# Altium schematic sheet 801_USBHub-Framework.SchDoc: USB Hub Framework Modules
size A2; Organization: Greenfield Tech Solutions; Address1: Molendreef 33; Address2: Ossendrecht; Address3: 4641CS; Address4: The Netherlands; SheetNumber: 9; SheetTotal: 9
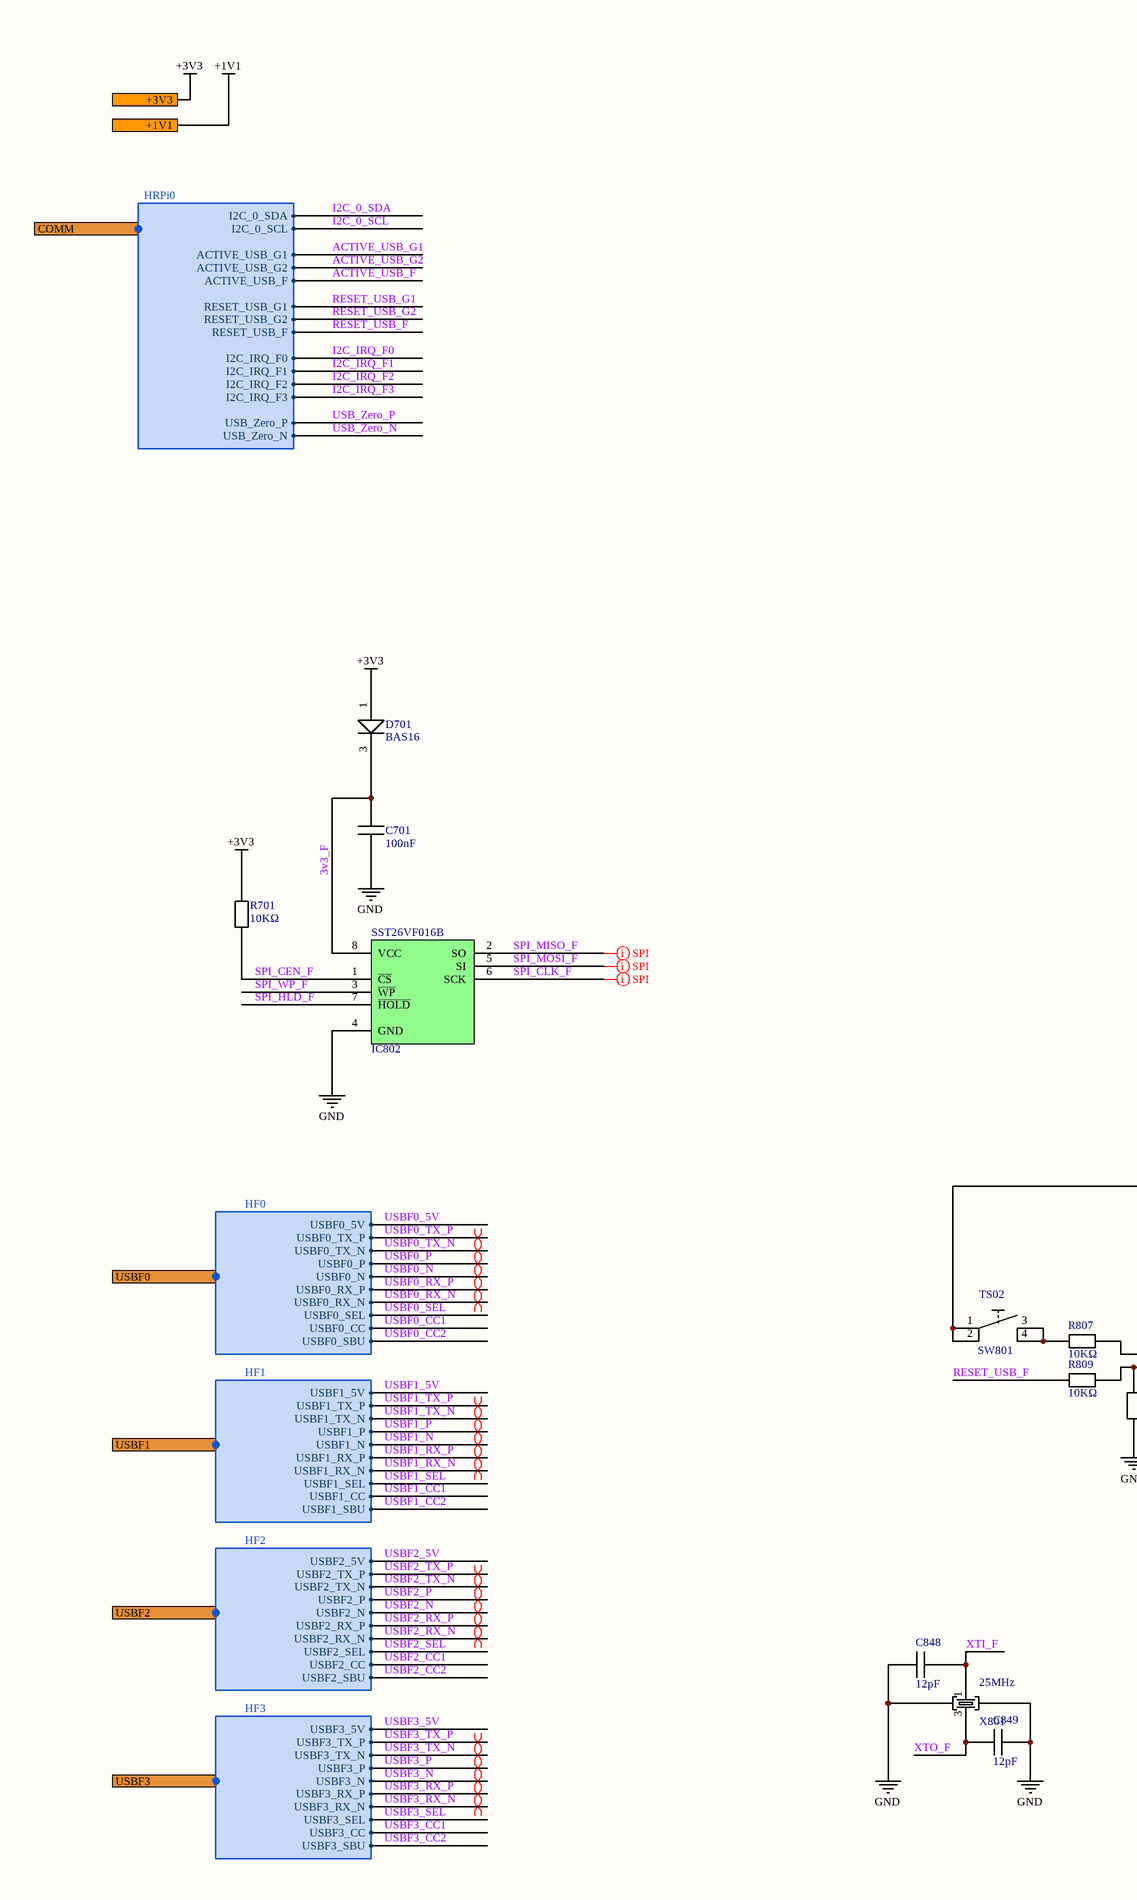
[diagram p0: 801_USBHub-Framework.SchDoc, left]
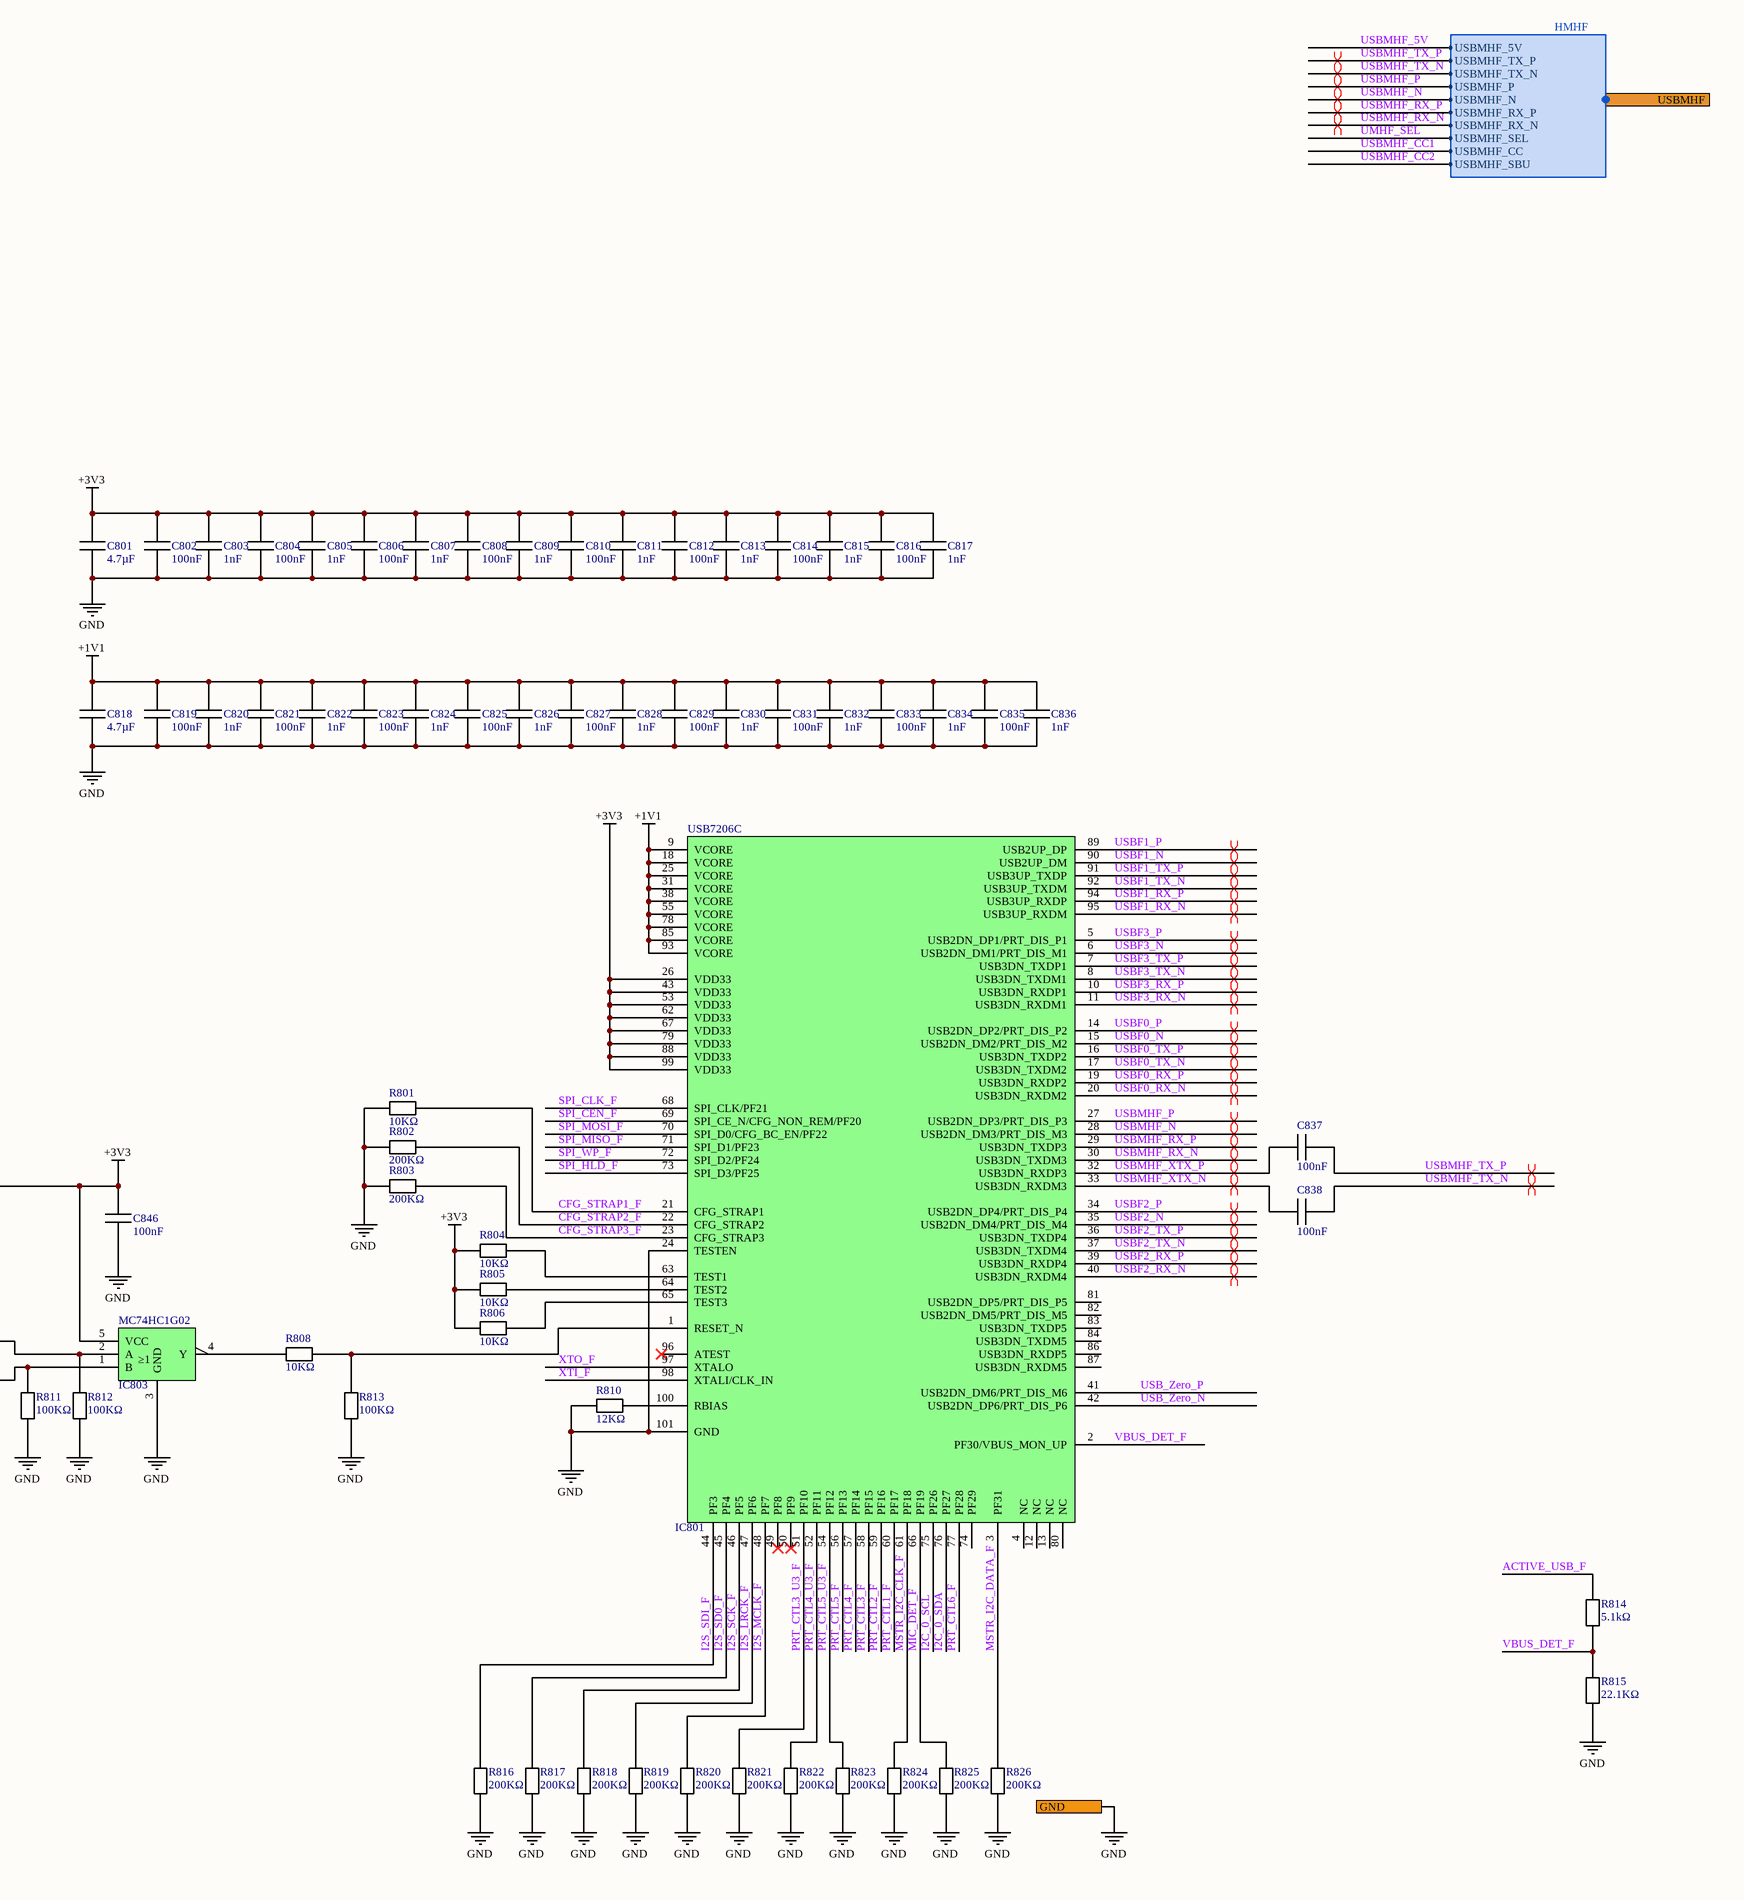
[diagram p1: 801_USBHub-Framework.SchDoc, right]

## Parts
C701  100nF  [C0402]
C801  4.7µF  [C0603]
C802  100nF  [C0402]
C803  1nF  [C0402]
C804  100nF  [C0402]
C805  1nF  [C0402]
C806  100nF  [C0402]
C807  1nF  [C0402]
C808  100nF  [C0402]
C809  1nF  [C0402]
C810  100nF  [C0402]
C811  1nF  [C0402]
C812  100nF  [C0402]
C813  1nF  [C0402]
C814  100nF  [C0402]
C815  1nF  [C0402]
C816  100nF  [C0402]
C817  1nF  [C0402]
C818  4.7µF  [C0603]
C819  100nF  [C0402]
C820  1nF  [C0402]
C821  100nF  [C0402]
C822  1nF  [C0402]
C823  100nF  [C0402]
C824  1nF  [C0402]
C825  100nF  [C0402]
C826  1nF  [C0402]
C827  100nF  [C0402]
C828  1nF  [C0402]
C829  100nF  [C0402]
C830  1nF  [C0402]
C831  100nF  [C0402]
C832  1nF  [C0402]
C833  100nF  [C0402]
C834  1nF  [C0402]
C835  100nF  [C0402]
C836  1nF  [C0402]
C837  100nF  [C0402]
C838  100nF  [C0402]
C846  100nF  [C0402]
C848  12pF  [C0402]
C849  12pF  [C0402]
D701  BAS16  [SOT-23]
IC801  USB7206C  [VQFN-100G_12X12]
IC802  SST26VF016B  [SO-8]
IC803  MC74HC1G02  [TSOP-5]
R701  10KΩ  [R0402]
R801  10KΩ  [R0402]
R802  200KΩ  [R0402]
R803  200KΩ  [R0402]
R804  10KΩ  [R0402]
R805  10KΩ  [R0402]
R806  10KΩ  [R0402]
R807  10KΩ  [R0402]
R808  10KΩ  [R0402]
R809  10KΩ  [R0402]
R810  12KΩ  [R0402]
R811  100KΩ  [R0402]
R812  100KΩ  [R0402]
R813  100KΩ  [R0402]
R814  5.1kΩ  [R0402]
R815  22.1KΩ  [R0603]
R816  200KΩ  [R0402]
R817  200KΩ  [R0402]
R818  200KΩ  [R0402]
R819  200KΩ  [R0402]
R820  200KΩ  [R0402]
R821  200KΩ  [R0402]
R822  200KΩ  [R0402]
R823  200KΩ  [R0402]
R824  200KΩ  [R0402]
R825  200KΩ  [R0402]
R826  200KΩ  [R0402]
SW801  TS02  [TS02]
X801  25MHz  [403W]

## Ports
+1V1, +3V3, COMM (harness HRPi0), GND, USBF0 (harness HF0), USBF1 (harness HF1), USBF2 (harness HF2), USBF3 (harness HF3), USBMHF (harness HMHF)

## Harnesses
HF0: USBF0_5V, USBF0_TX_P, USBF0_TX_N, USBF0_N, USBF0_RX_P, USBF0_RX_N, USBF0_SEL, USBF0_P, USBF0_CC, USBF0_SBU
HF1: USBF1_5V, USBF1_TX_P, USBF1_TX_N, USBF1_N, USBF1_RX_P, USBF1_RX_N, USBF1_SEL, USBF1_P, USBF1_CC, USBF1_SBU
HF2: USBF2_5V, USBF2_TX_P, USBF2_TX_N, USBF2_N, USBF2_RX_P, USBF2_RX_N, USBF2_SEL, USBF2_P, USBF2_CC, USBF2_SBU
HF3: USBF3_5V, USBF3_TX_P, USBF3_TX_N, USBF3_N, USBF3_RX_P, USBF3_RX_N, USBF3_SEL, USBF3_P, USBF3_CC, USBF3_SBU
HMHF: USBMHF_5V, USBMHF_TX_P, USBMHF_TX_N, USBMHF_N, USBMHF_RX_P, USBMHF_RX_N, USBMHF_SEL, USBMHF_P, USBMHF_CC, USBMHF_SBU
HRPi0: I2C_0_SCL, I2C_0_SDA, I2C_IRQ_F0, I2C_IRQ_F1, I2C_IRQ_F3, I2C_IRQ_F2, ACTIVE_USB_G1, ACTIVE_USB_F, ACTIVE_USB_G2, RESET_USB_G1, RESET_USB_F, RESET_USB_G2, USB_Zero_N, USB_Zero_P

## Nets
+1V1: C818.1 C819.1 C820.1 C821.1 C822.1 C823.1 C824.1 C825.1 C826.1 C827.1 C828.1 C829.1 C830.1 C831.1 C832.1 C833.1 C834.1 C835.1 C836.1 IC801.9(VCORE) IC801.18(VCORE) IC801.25(VCORE) IC801.31(VCORE) IC801.38(VCORE) IC801.55(VCORE) IC801.78(VCORE) IC801.85(VCORE) IC801.93(VCORE) ; port +1V1
+3V3: C801.1 C802.1 C803.1 C804.1 C805.1 C806.1 C807.1 C808.1 C809.1 C810.1 C811.1 C812.1 C813.1 C814.1 C815.1 C816.1 C817.1 C846.1 D701.1(A) IC801.26(VDD33) IC801.43(VDD33) IC801.53(VDD33) IC801.62(VDD33) IC801.67(VDD33) IC801.79(VDD33) IC801.88(VDD33) IC801.99(VDD33) IC803.5(VCC) R701.2 R804.1 R805.1 R806.1 SW801.1 SW801.2 ; port +3V3
GND: C701.2 C801.2 C802.2 C803.2 C804.2 C805.2 C806.2 C807.2 C808.2 C809.2 C810.2 C811.2 C812.2 C813.2 C814.2 C815.2 C816.2 C817.2 C818.2 C819.2 C820.2 C821.2 C822.2 C823.2 C824.2 C825.2 C826.2 C827.2 C828.2 C829.2 C830.2 C831.2 C832.2 C833.2 C834.2 C835.2 C836.2 C846.2 C848.1 C849.2 IC801.24(TESTEN) IC801.101(GND) IC802.4(GND) IC803.3(GND) R801.2 R802.1 R803.1 R810.1 R811.1 R812.1 R813.1 R815.1 R816.1 R817.1 R818.1 R819.1 R820.1 R821.1 R822.1 R823.1 R824.1 R825.1 R826.1 X801.2 X801.4 ; port GND
3v3_F: C701.1 D701.3(K) IC802.8(VCC)
ACTIVE_USB_F: R814.2 ; port COMM.ACTIVE_USB_F
ACTIVE_USB_G1: port COMM.ACTIVE_USB_G1
ACTIVE_USB_G2: port COMM.ACTIVE_USB_G2
CFG_STRAP1_F: IC801.21(CFG_STRAP1) R801.1
CFG_STRAP2_F: IC801.22(CFG_STRAP2) R802.2
CFG_STRAP3_F: IC801.23(CFG_STRAP3) R803.2
I2C_0_SCL: IC801.75(PF26) ; port COMM.I2C_0_SCL
I2C_0_SDA: IC801.76(PF27) ; port COMM.I2C_0_SDA
I2C_IRQ_F0: port COMM.I2C_IRQ_F0
I2C_IRQ_F1: port COMM.I2C_IRQ_F1
I2C_IRQ_F2: port COMM.I2C_IRQ_F2
I2C_IRQ_F3: port COMM.I2C_IRQ_F3
I2S_LRCK_F: IC801.47(PF6) R819.2
I2S_MCLK_F: IC801.48(PF7) R820.2
I2S_SCK_F: IC801.46(PF5) R818.2
I2S_SD0_F: IC801.45(PF4) R817.2
I2S_SDI_F: IC801.44(PF3) R816.2
MIC_DET_F: IC801.66(PF19) R825.2
MSTR_I2C_CLK_F: IC801.61(PF18) R824.2
MSTR_I2C_DATA_F: IC801.3(PF31) R826.2
PRT_CTL1_F: IC801.60(PF17)
PRT_CTL2_F: IC801.59(PF16)
PRT_CTL3_F: IC801.58(PF15)
PRT_CTL3_U3_F: IC801.51(PF10) R821.2
PRT_CTL4_F: IC801.57(PF14)
PRT_CTL4_U3_F: IC801.52(PF11) R822.2
PRT_CTL5_F: IC801.56(PF13)
PRT_CTL5_U3_F: IC801.54(PF12) R823.2
PRT_CTL6_F: IC801.77(PF28)
RESET_USB_F: R809.2 ; port COMM.RESET_USB_F
RESET_USB_G1: port COMM.RESET_USB_G1
RESET_USB_G2: port COMM.RESET_USB_G2
SPI_CEN_F: IC801.69(SPI_CE_N/CFG_NON_REM/PF20) IC802.1(~{CS}) R701.1
SPI_CLK_F: IC801.68(SPI_CLK/PF21) IC802.6(SCK)
SPI_HLD_F: IC801.73(SPI_D3/PF25) IC802.7(~{HOLD})
SPI_MISO_F: IC801.71(SPI_D1/PF23) IC802.2(SO)
SPI_MOSI_F: IC801.70(SPI_D0/CFG_BC_EN/PF22) IC802.5(SI)
SPI_WP_F: IC801.72(SPI_D2/PF24) IC802.3(~{WP})
UMHF_SEL: port USBMHF.USBMHF_SEL
USB_Zero_N: IC801.42(USB2DN_DP6/PRT_DIS_P6) ; port COMM.USB_Zero_N
USB_Zero_P: IC801.41(USB2DN_DM6/PRT_DIS_M6) ; port COMM.USB_Zero_P
USBF0_5V: port USBF0.USBF0_5V
USBF0_CC1: port USBF0.USBF0_CC
USBF0_CC2: port USBF0.USBF0_SBU
USBF0_N: IC801.15(USB2DN_DM2/PRT_DIS_M2) ; port USBF0.USBF0_N
USBF0_P: IC801.14(USB2DN_DP2/PRT_DIS_P2) ; port USBF0.USBF0_P
USBF0_RX_N: IC801.20(USB3DN_RXDM2) ; port USBF0.USBF0_RX_N
USBF0_RX_P: IC801.19(USB3DN_RXDP2) ; port USBF0.USBF0_RX_P
USBF0_SEL: port USBF0.USBF0_SEL
USBF0_TX_N: IC801.17(USB3DN_TXDM2) ; port USBF0.USBF0_TX_N
USBF0_TX_P: IC801.16(USB3DN_TXDP2) ; port USBF0.USBF0_TX_P
USBF1_5V: port USBF1.USBF1_5V
USBF1_CC1: port USBF1.USBF1_CC
USBF1_CC2: port USBF1.USBF1_SBU
USBF1_N: IC801.90(USB2UP_DM) ; port USBF1.USBF1_N
USBF1_P: IC801.89(USB2UP_DP) ; port USBF1.USBF1_P
USBF1_RX_N: IC801.95(USB3UP_RXDM) ; port USBF1.USBF1_RX_N
USBF1_RX_P: IC801.94(USB3UP_RXDP) ; port USBF1.USBF1_RX_P
USBF1_SEL: port USBF1.USBF1_SEL
USBF1_TX_N: IC801.92(USB3UP_TXDM) ; port USBF1.USBF1_TX_N
USBF1_TX_P: IC801.91(USB3UP_TXDP) ; port USBF1.USBF1_TX_P
USBF2_5V: port USBF2.USBF2_5V
USBF2_CC1: port USBF2.USBF2_CC
USBF2_CC2: port USBF2.USBF2_SBU
USBF2_N: IC801.35(USB2DN_DM4/PRT_DIS_M4) ; port USBF2.USBF2_N
USBF2_P: IC801.34(USB2DN_DP4/PRT_DIS_P4) ; port USBF2.USBF2_P
USBF2_RX_N: IC801.40(USB3DN_RXDM4) ; port USBF2.USBF2_RX_N
USBF2_RX_P: IC801.39(USB3DN_RXDP4) ; port USBF2.USBF2_RX_P
USBF2_SEL: port USBF2.USBF2_SEL
USBF2_TX_N: IC801.37(USB3DN_TXDM4) ; port USBF2.USBF2_TX_N
USBF2_TX_P: IC801.36(USB3DN_TXDP4) ; port USBF2.USBF2_TX_P
USBF3_5V: port USBF3.USBF3_5V
USBF3_CC1: port USBF3.USBF3_CC
USBF3_CC2: port USBF3.USBF3_SBU
USBF3_N: IC801.6(USB2DN_DM1/PRT_DIS_M1) ; port USBF3.USBF3_N
USBF3_P: IC801.5(USB2DN_DP1/PRT_DIS_P1) ; port USBF3.USBF3_P
USBF3_RX_N: IC801.11(USB3DN_RXDM1) ; port USBF3.USBF3_RX_N
USBF3_RX_P: IC801.10(USB3DN_RXDP1) ; port USBF3.USBF3_RX_P
USBF3_SEL: port USBF3.USBF3_SEL
USBF3_TX_N: IC801.8(USB3DN_TXDM1) ; port USBF3.USBF3_TX_N
USBF3_TX_P: IC801.7(USB3DN_TXDP1) ; port USBF3.USBF3_TX_P
USBMHF_5V: port USBMHF.USBMHF_5V
USBMHF_CC1: port USBMHF.USBMHF_CC
USBMHF_CC2: port USBMHF.USBMHF_SBU
USBMHF_N: IC801.28(USB2DN_DM3/PRT_DIS_M3) ; port USBMHF.USBMHF_N
USBMHF_P: IC801.27(USB2DN_DP3/PRT_DIS_P3) ; port USBMHF.USBMHF_P
USBMHF_RX_N: IC801.30(USB3DN_TXDM3) ; port USBMHF.USBMHF_RX_N
USBMHF_RX_P: IC801.29(USB3DN_TXDP3) ; port USBMHF.USBMHF_RX_P
USBMHF_TX_N: C838.2 ; port USBMHF.USBMHF_TX_N
USBMHF_TX_P: C837.2 ; port USBMHF.USBMHF_TX_P
USBMHF_XTX_N: C838.1 IC801.33(USB3DN_RXDM3)
USBMHF_XTX_P: C837.1 IC801.32(USB3DN_RXDP3)
VBUS_DET_F: IC801.2(PF30/VBUS_MON_UP) R814.1 R815.2
XTI_F: C848.2 IC801.98(XTALI/CLK_IN) X801.1
XTO_F: C849.1 IC801.97(XTALO) X801.3
NetIC801_1: IC801.1(RESET_N) R808.2 R813.2
NetIC801_63: IC801.63(TEST1) R804.2
NetIC801_64: IC801.64(TEST2) R805.2
NetIC801_65: IC801.65(TEST3) R806.2
NetIC801_100: IC801.100(RBIAS) R810.2
NetIC803_1: IC803.1(B) R809.1 R811.2
NetIC803_2: IC803.2(A) R807.1 R812.2
NetIC803_4: IC803.4(Y) R808.1
NetR807_2: R807.2 SW801.3 SW801.4

Not connected (* = marked no-connect by the designer): IC801 4(NC) 12(NC) 13(NC) 49(PF8)* 50(PF9)* 74(PF29) 80(NC) 81(USB2DN_DP5/PRT_DIS_P5) 82(USB2DN_DM5/PRT_DIS_M5) 83(USB3DN_TXDP5) 84(USB3DN_TXDM5) 86(USB3DN_RXDP5) 87(USB3DN_RXDM5) 96(ATEST)*

## Layout directives
differential pair; differential pair class USB3: USBF0_N, USBF0_P, USBF0_RX_N, USBF0_RX_P, USBF0_TX_N, USBF0_TX_P, USBF1_N, USBF1_P, USBF1_RX_N, USBF1_RX_P, USBF1_TX_N, USBF1_TX_P, USBF2_N, USBF2_P, USBF2_RX_N, USBF2_RX_P, USBF2_TX_N, USBF2_TX_P, USBF3_N, USBF3_P, USBF3_RX_N, USBF3_RX_P, USBF3_TX_N, USBF3_TX_P, USBMHF_N, USBMHF_P, USBMHF_RX_N, USBMHF_RX_P, USBMHF_TX_N, USBMHF_TX_P, USBMHF_XTX_N, USBMHF_XTX_P
net class SPI_FW: SPI_CLK_F, SPI_MISO_F, SPI_MOSI_F

## Notes on the sheet
- Title
- Size:
- Date:
- File:
- A2
- Number:
- Time:
- Revision:
- Sheet
- of
- (in symbol IC0061) ≥1

## Library data of the parts
C701 C802 C804 C806 C808 C810 C812 C814 C816 C819 C821 C823 C825 C827 C829 C831 C833 C835 C837 C838 C846 = CA0010: 100nF 16V 10% X7R; Part Number: CA0010; ManfactPart: GCM155R71C104KA55D; ID: 10; RefVal: 100nF
C801 C818 = CA0002: 4.7µF 16V 10% X5R; Part Number: CA0002; ManfactPart: C1608X5R1C475K080AC; ID: 2; RefVal: 4.7µF
C803 C805 C807 C809 C811 C813 C815 C817 C820 C822 C824 C826 C828 C830 C832 C834 C836 = CA0031: 1nF 50V 1% C0G; Part Number: CA0031; ManfactPart: GRT1555C1H102FA02D; ID: 31; RefVal: 1nF
C848 C849 = CA0059: 12pF 16V 1% C0G; Part Number: CA0059; ManfactPart: VJ0402A120FXJCW1BC; ID: 59; RefVal: 12pF
D701 = DI0010: Diodes - General Purpose, Power, Switching 100Vll Signal Switching Diodes 2A; Part Number: DI0010; ManfactPart: BAS16_R1_00001; ID: 10; RefVal: BAS16
IC801 = IC0065: 6-Port USB 3.2 Gen 2 Controller Hub; Part Number: IC0065; ID: 65; RefVal: USB7206C; ManfactPart: USB7206C
IC802 = IC0059: 16 Mbit Serial Quad I/O (SQI) Flash Memory; Part Number: IC0059; ManfactPart: SST26VF016B-104I/SM; ID: 59; RefVal: SST26VF016B
IC803 = IC0061: Logic Gates 2-6V Single 2-Input NOR; Part Number: IC0061; ManfactPart: MC74HC1G02DTT1G; ID: 61; RefVal: MC74HC1G02
R701 R801 R804-R809 = RS0011: 10KΩ 1% 62.5mW; Part Number: RS0011; ManfactPart: WR04X1002FTL; ID: 11; RefVal: 10KΩ
R802 R803 R816-R826 = RS0045: 200KΩ 1% 62.5mW 100PPM; Part Number: RS0045; ManfactPart: CRG0402F200K; ID: 45; RefVal: 200KΩ
R810 = RS0015: 12KΩ 1% 62.5mW; Part Number: RS0015; ManfactPart: RC0402FR-1312KL; ID: 15; RefVal: 12KΩ
R811-R813 = RS0036: 100KΩ 1% 62.5mW 100PPM; Part Number: RS0036; ManfactPart: AC0402FR-13100KL; ID: 36; RefVal: 100KΩ
R814 = RS0038: 5.1KΩ 1% 62.5mW 100PPM; Part Number: RS0038; ManfactPart: CRCW04025K10FKEDC; ID: 38; RefVal: 5.1kΩ
R815 = RS0040: 22.1KΩ 1% 100mW 100PPM; Part Number: RS0040; ManfactPart: RC0603FR-0722K1L; ID: 40; RefVal: 22.1KΩ
SW801 = SW0005: TACTILE SWITCH SPST; Part Number: SW0005; ManfactPart: TS02-66-50-BK-160-SCR-D; ID: 5; RefVal: TS02
X801 = CR0003: 25MHz 8pF 20PPM; Part Number: CR0003; ManfactPart: 403WF25012IK; ID: 3; RefVal: 25MHz